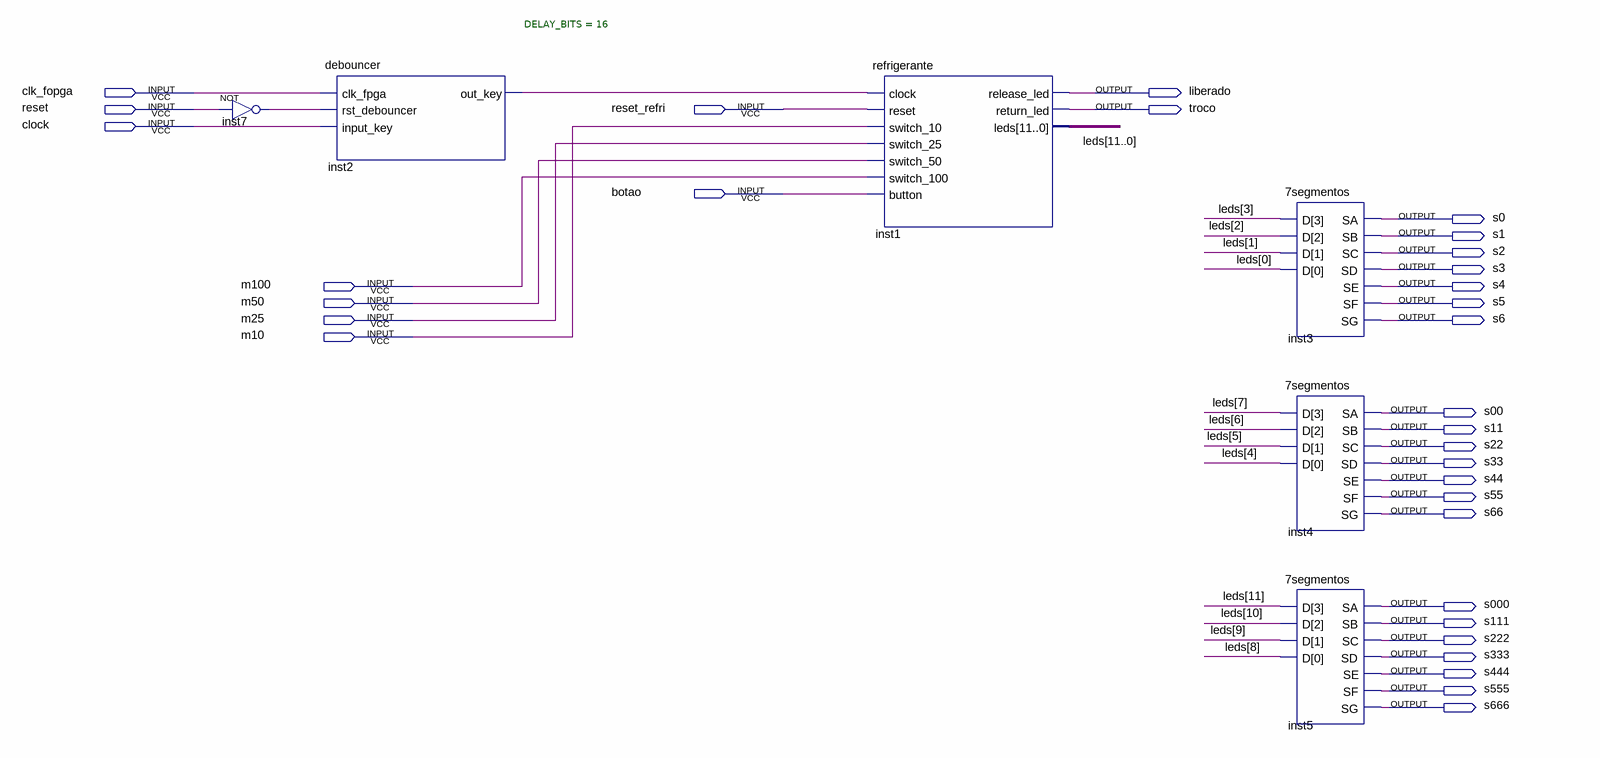
[diagram p0: schematic sheet]
// Quartus schematic test.bdf as structural Verilog: 6 symbols, 32 pins
module test (
  input  clk_fopga,
  input  reset,
  input  reset_refri,
  input  clock,
  input  botao,
  input  m100,
  input  m50,
  input  m25,
  input  m10,
  output liberado,
  output troco,
  output s0,
  output s1,
  output s2,
  output s3,
  output s4,
  output s5,
  output s6,
  output s00,
  output s11,
  output s22,
  output s33,
  output s44,
  output s55,
  output s66,
  output s000,
  output s111,
  output s222,
  output s333,
  output s444,
  output s555,
  output s666
);

  wire inst2_out_key, inst7_out;
  wire [11:0] leds;

  not inst7 (inst7_out, reset);
  debouncer #(.DELAY_BITS(16)) inst2 (
    .clk_fpga(clk_fopga), .rst_debouncer(inst7_out), .input_key(clock), .out_key(inst2_out_key));
  refrigerante inst1 (
    .clock(inst2_out_key), .reset(reset_refri), .switch_10(m10), .switch_25(m25), .switch_50(m50),
    .switch_100(m100), .button(botao), .release_led(liberado), .return_led(troco), .leds(leds));
  \7segmentos  inst3 (.D(leds[3:0]), .SA(s0), .SB(s1), .SC(s2), .SD(s3), .SE(s4), .SF(s5), .SG(s6));
  \7segmentos  inst4 (.D(leds[7:4]), .SA(s00), .SB(s11), .SC(s22), .SD(s33), .SE(s44), .SF(s55), .SG(s66));
  \7segmentos  inst5 (.D(leds[11:8]), .SA(s000), .SB(s111), .SC(s222), .SD(s333), .SE(s444), .SF(s555), .SG(s666));
endmodule
